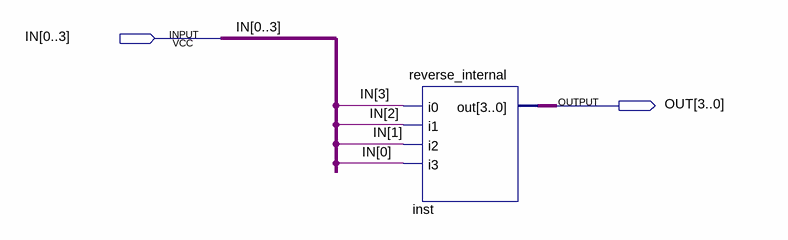
[diagram p0: schematic sheet]
// Quartus schematic reverse_bus.bdf as structural Verilog: 1 symbols, 2 pins
module reverse_bus (
  input  [0:3] IN,
  output [3:0] OUT
);

  reverse_internal inst (.i0(IN[3]), .i1(IN[2]), .i2(IN[1]), .i3(IN[0]), .out(OUT));
endmodule
